# Altium schematic sheet BMP180_PRESSURE_SENSOR_I2C.SchDoc
size A4
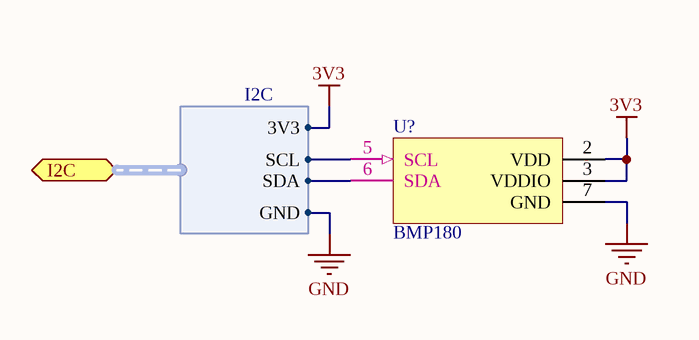
[diagram p0: BMP180_PRESSURE_SENSOR_I2C.SchDoc]

## Parts
U?  BMP180  [LGA 7 pin]

## Ports
I2C (harness I2C)

## Harnesses
I2C: SDA, SCL, 3V3, GND

## Nets
3V3: U?.2(VDD) U?.3(VDDIO) ; port I2C.3V3
GND: U?.7(GND) ; port I2C.GND
NetU?_5: U?.5(SCL) ; port I2C.SCL
NetU?_6: U?.6(SDA) ; port I2C.SDA

## Library data of the parts
U? = BMP180: Bosch I2c pressure sensor